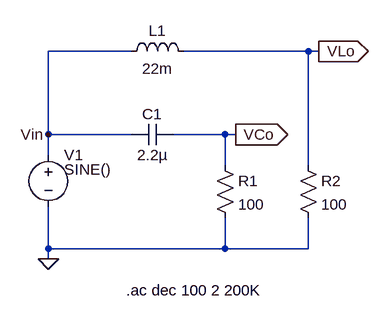
[diagram p0: schematic PassiveFilters spice.asc]
PassiveFilters spice.asc, the LTspice schematic file:
Version 4
SHEET 1 880 680
WIRE 256 144 128 144
WIRE 528 144 336 144
WIRE 544 144 528 144
WIRE 128 272 128 144
WIRE 256 272 128 272
WIRE 400 272 320 272
WIRE 416 272 400 272
WIRE 128 304 128 272
WIRE 400 320 400 272
WIRE 528 320 528 144
WIRE 128 448 128 384
WIRE 400 448 400 400
WIRE 400 448 128 448
WIRE 528 448 528 400
WIRE 528 448 400 448
WIRE 128 464 128 448
FLAG 128 464 0
FLAG 544 144 VLo
IOPIN 544 144 Out
FLAG 416 272 VCo
IOPIN 416 272 Out
FLAG 128 272 Vin
SYMBOL voltage 128 288 R0
WINDOW 3 24 38 Left 2
SYMATTR Value SINE()
SYMATTR InstName V1
SYMATTR Value2 AC 3V
SYMBOL ind 240 160 R270
WINDOW 0 32 56 VTop 2
WINDOW 3 5 56 VBottom 2
SYMATTR InstName L1
SYMATTR Value 22m
SYMATTR SpiceLine Ipk=190m Cpar=0 mfg="   ---" pn="   ---"
SYMBOL cap 320 256 R90
WINDOW 0 0 32 VBottom 2
WINDOW 3 32 32 VTop 2
SYMATTR InstName C1
SYMATTR Value 2.2µ
SYMBOL res 384 304 R0
SYMATTR InstName R1
SYMATTR Value 100
SYMBOL res 512 304 R0
SYMATTR InstName R2
SYMATTR Value 100
TEXT 248 512 Left 2 !.ac dec 100 2 200K

The netlist it stands for:
* PassiveFilters spice.asc
V1 Vin 0 SINE() AC 3V
L1 Vin VLo 22m Ipk=190m Cpar=0 mfg="   ---" pn="   ---"
C1 VCo Vin 2.2µ
R1 VCo 0 100
R2 VLo 0 100
.ac dec 100 2 200K
.backanno
.end